# EAGLE design UniversalInterface_RevA (EAGLE 7.6.0)

## Sheet 1 of 2
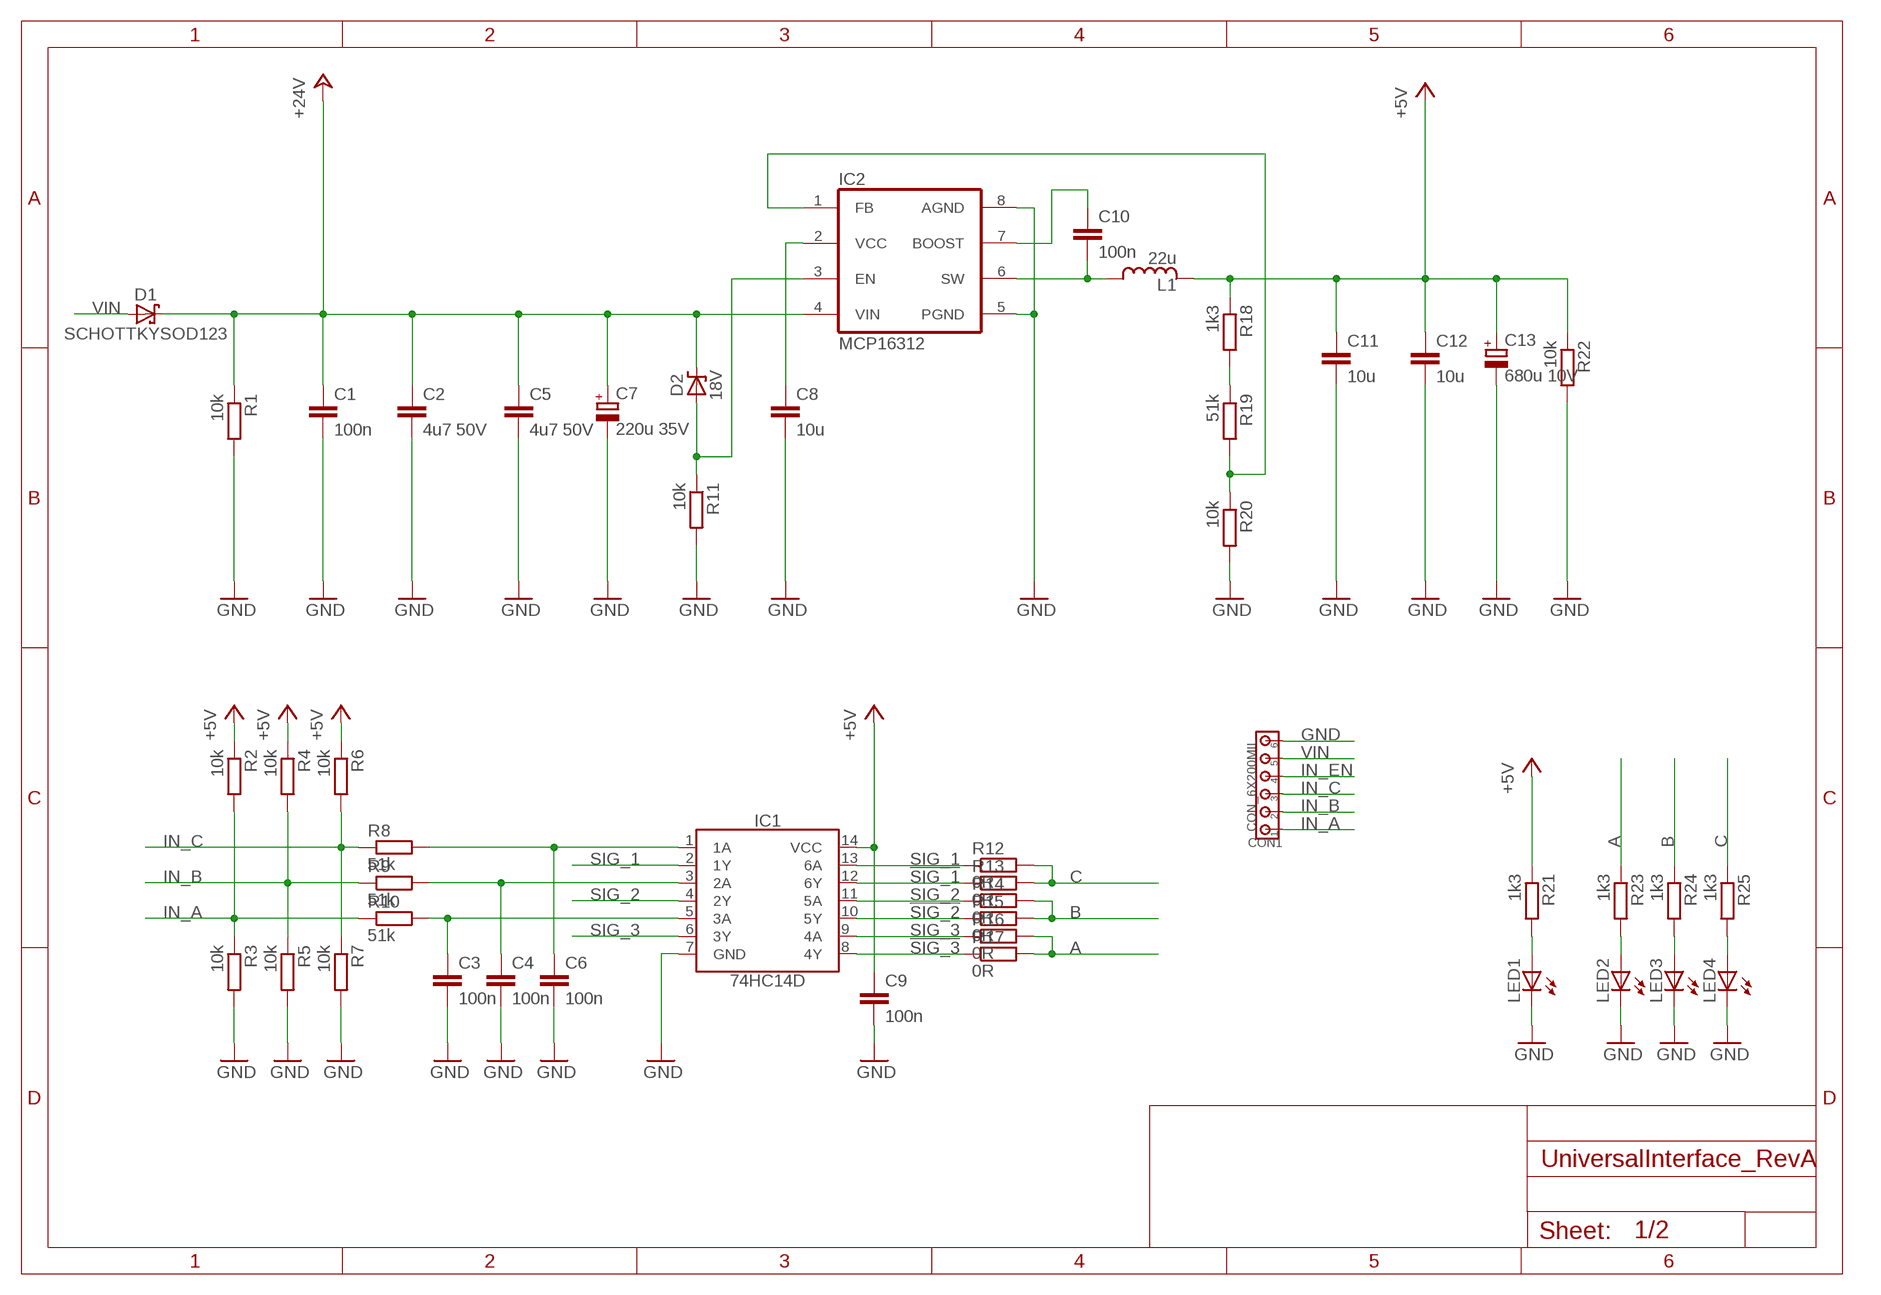
[diagram p0: schematic, sheet 1]

### Parts
C1  100n  CC0805  [C0805]
C2  4u7 50V  CC1206  [C1206]
C3  100n  CC0805  [C0805]
C4  100n  CC0805  [C0805]
C5  4u7 50V  CC1206  [C1206]
C6  100n  CC0805  [C0805]
C7  220u 35V  C_POLARIZED8MM  [8MM]
C8  10u  CC0805  [C0805]
C9  100n  CC0805  [C0805]
C10  100n  CC0805  [C0805]
C11  10u  CC0805  [C0805]
C12  10u  CC0805  [C0805]
C13  680u 10V  C_POLARIZED8MM  [8MM]
CON1  CON_6X200MIL  [200MIL_6X]
D1  SCHOTTKYSOD123  [SOD123]
D2  18V  ZENERSOD323  [SOD323]
IC1  74HC14D  [SO14]
IC2  MCP16312  MCP16311  [MSOP8]
L1  22u  INDUCTORLPS4018  [LPS4018]
LED1  LED0805_NB  [LED0805_NOBOARDER]
LED2  LED0805_NB  [LED0805_NOBOARDER]
LED3  LED0805_NB  [LED0805_NOBOARDER]
LED4  LED0805_NB  [LED0805_NOBOARDER]
R1  10k  RESISTORR0805  [R0805]
R2  10k  RESISTORR0805  [R0805]
R3  10k  RESISTORR0805  [R0805]
R4  10k  RESISTORR0805  [R0805]
R5  10k  RESISTORR0805  [R0805]
R6  10k  RESISTORR0805  [R0805]
R7  10k  RESISTORR0805  [R0805]
R8  51k  RESISTORR0805  [R0805]
R9  51k  RESISTORR0805  [R0805]
R10  51k  RESISTORR0805  [R0805]
R11  10k  RESISTORR0805  [R0805]
R12  0R  RESISTORR0805  [R0805]
R13  0R  RESISTORR0805  [R0805]
R14  0R  RESISTORR0805  [R0805]
R15  0R  RESISTORR0805  [R0805]
R16  0R  RESISTORR0805  [R0805]
R17  0R  RESISTORR0805  [R0805]
R18  1k3  RESISTORR0805  [R0805]
R19  51k  RESISTORR0805  [R0805]
R20  10k  RESISTORR0805  [R0805]
R21  1k3  RESISTORR0805  [R0805]
R22  10k  RESISTORR0805  [R0805]
R23  1k3  RESISTORR0805  [R0805]
R24  1k3  RESISTORR0805  [R0805]
R25  1k3  RESISTORR0805  [R0805]

### Nets
!SIG_1!: IC1.12(6Y) R13.1
!SIG_2!: IC1.10(5Y) R15.1
!SIG_3!: IC1.8(4Y) R17.1
+5V: C9.1 C11.1 C12.1 C13.+ IC1.14(VCC) L1.2 R2.1 R4.1 R6.1 R18.1 R21.1 R22.1 ; also sheet 2
+24V: C1.1 C2.1 C5.1 C7.+ D1.C D2.C IC2.4(VIN) R1.1 ; also sheet 2
A: R16.2 R17.2 R23.1 ; also sheet 2
B: R14.2 R15.2 R24.1 ; also sheet 2
BOOST: C10.1 IC2.7(BOOST)
C: R12.2 R13.2 R25.1 ; also sheet 2
FOO: C3.1 IC1.5(3A) R10.2
GND: C1.2 C2.2 C3.2 C4.2 C5.2 C6.2 C7.- C8.2 C9.2 C11.2 C12.2 C13.- CON1.6 IC1.7(GND) IC2.5(PGND) IC2.8(AGND) LED1.C LED2.C LED3.C LED4.C R1.2 R3.2 R5.2 R7.2 R11.2 R20.2 R22.2 ; also sheet 2
IN_A: CON1.1 R2.2 R3.1 R10.1
IN_B: CON1.2 R4.2 R5.1 R9.1
IN_C: CON1.3 R6.2 R7.1 R8.1
IN_EN: CON1.4 ; also sheet 2
N$1: IC2.1(FB) R19.2 R20.1
N$6: LED1.A R21.2
N$8: D2.A IC2.3(EN) R11.1
N$13: R18.2 R19.1
N$14: C8.1 IC2.2(VCC)
N$17: LED2.A R23.2
N$18: LED3.A R24.2
N$19: LED4.A R25.2
N$40: C6.1 IC1.1(1A) R8.2
N$41: C4.1 IC1.3(2A) R9.2
SIG_1: IC1.2(1Y) IC1.13(6A) R12.1
SIG_2: IC1.4(2Y) IC1.11(5A) R14.1
SIG_3: IC1.6(3Y) IC1.9(4A) R16.1
SWITCH: C10.2 IC2.6(SW) L1.1
VIN: CON1.5 D1.A

## Sheet 2 of 2
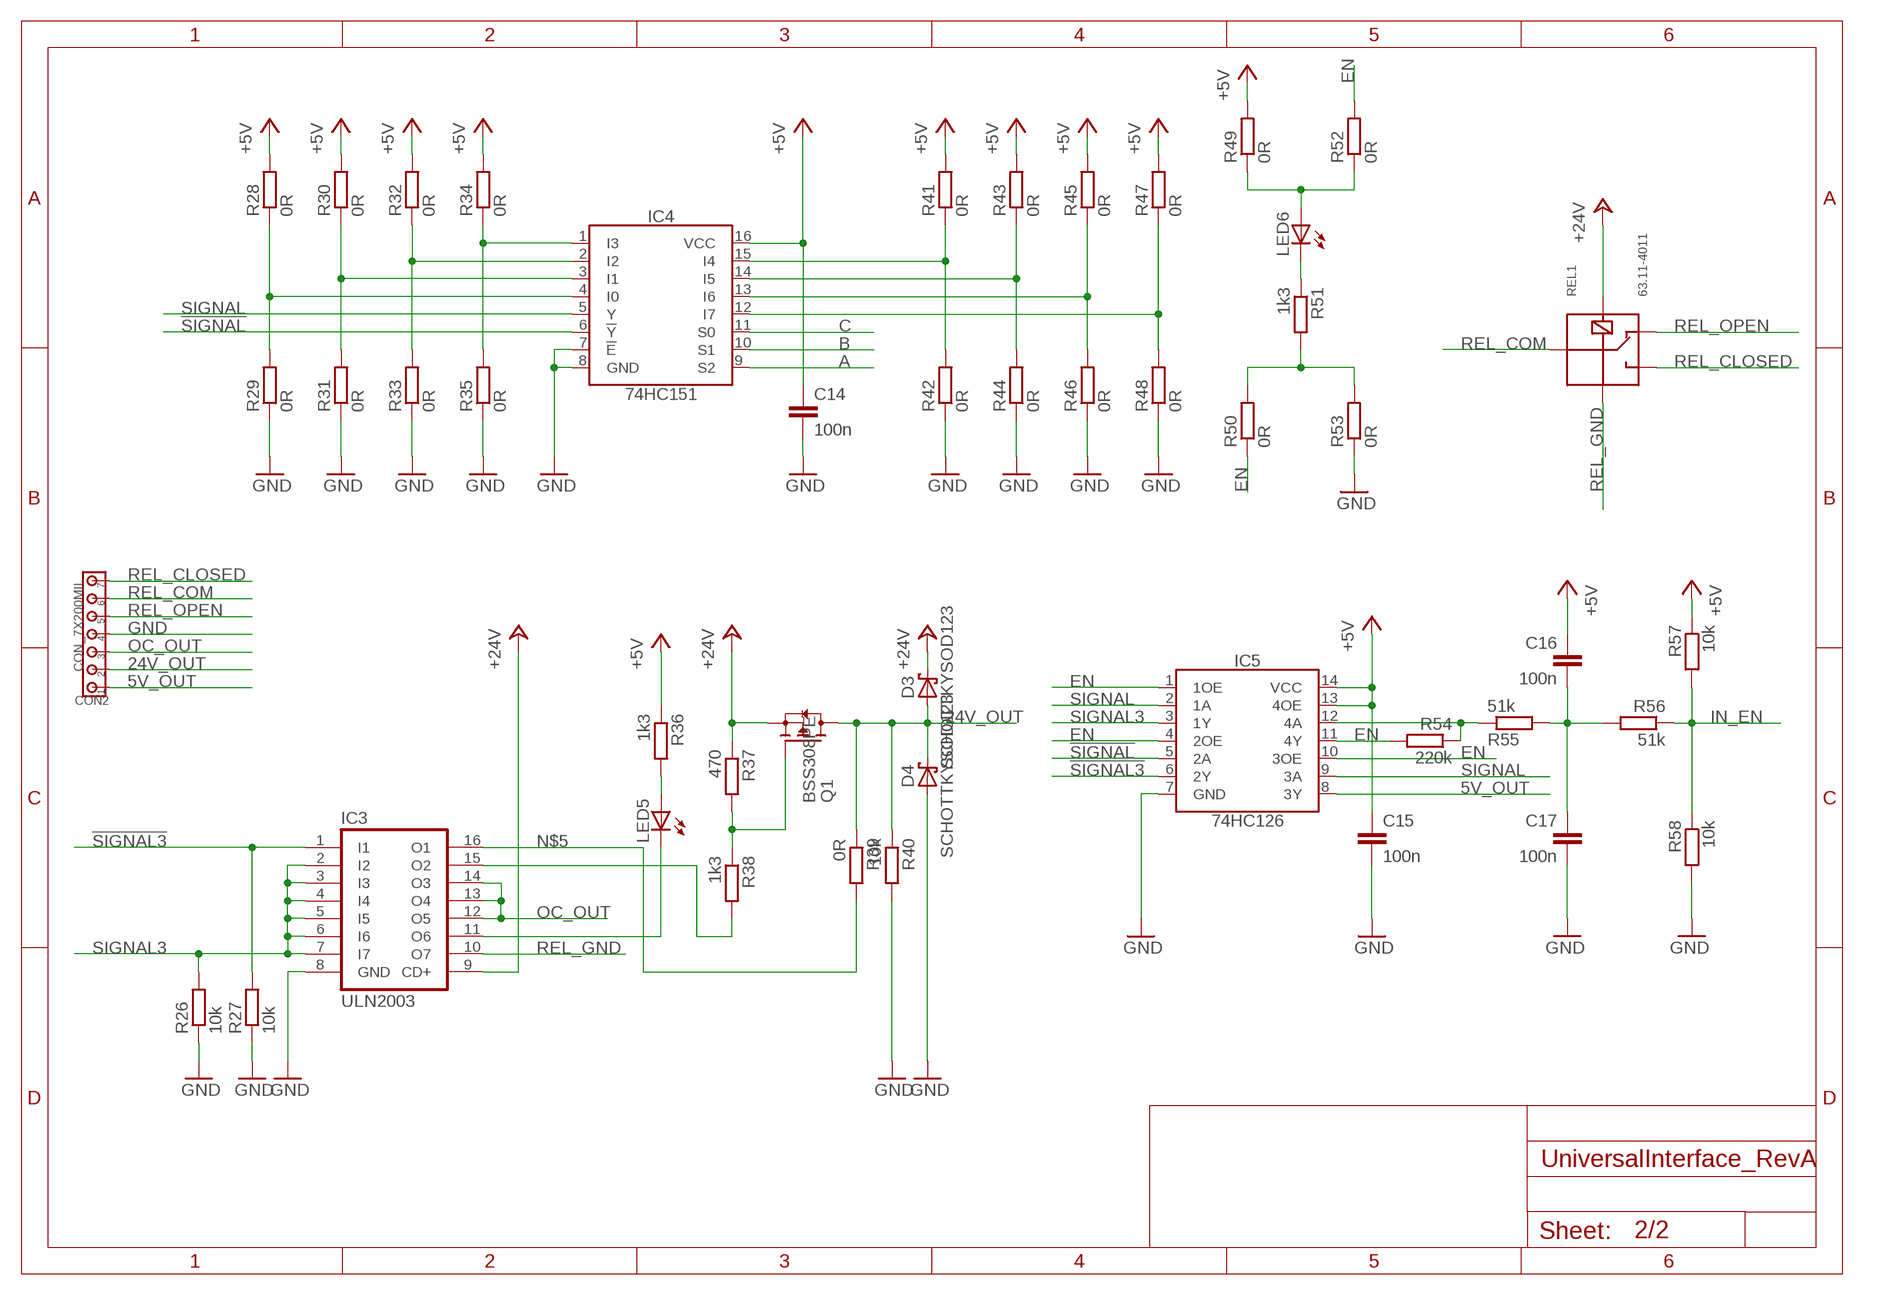
[diagram p1: schematic, sheet 2]

### Parts
C14  100n  CC0805  [C0805]
C15  100n  CC0805  [C0805]
C16  100n  CC0805  [C0805]
C17  100n  CC0805  [C0805]
CON2  CON_7X200MIL  [200MIL_7X]
D3  SCHOTTKYSOD123  [SOD123]
D4  SCHOTTKYSOD123  [SOD123]
IC3  ULN2003  [SO16]
IC4  74HC151  [SO16]
IC5  74HC126  [SO14]
LED5  LED0805_NB  [LED0805_NOBOARDER]
LED6  LED0805_NB  [LED0805_NOBOARDER]
Q1  BSS308PE  P-FETSOT23  [SOT23]
R26  10k  RESISTORR0805  [R0805]
R27  10k  RESISTORR0805  [R0805]
R28  0R  RESISTORR0805_NS  [R0805_NOSILK]
R29  0R  RESISTORR0805_NS  [R0805_NOSILK]
R30  0R  RESISTORR0805_NS  [R0805_NOSILK]
R31  0R  RESISTORR0805_NS  [R0805_NOSILK]
R32  0R  RESISTORR0805_NS  [R0805_NOSILK]
R33  0R  RESISTORR0805_NS  [R0805_NOSILK]
R34  0R  RESISTORR0805_NS  [R0805_NOSILK]
R35  0R  RESISTORR0805_NS  [R0805_NOSILK]
R36  1k3  RESISTORR0805  [R0805]
R37  470  RESISTORR0805  [R0805]
R38  1k3  RESISTORR0805  [R0805]
R39  0R  RESISTORR0805  [R0805]
R40  10k  RESISTORR0805  [R0805]
R41  0R  RESISTORR0805_NS  [R0805_NOSILK]
R42  0R  RESISTORR0805_NS  [R0805_NOSILK]
R43  0R  RESISTORR0805_NS  [R0805_NOSILK]
R44  0R  RESISTORR0805_NS  [R0805_NOSILK]
R45  0R  RESISTORR0805_NS  [R0805_NOSILK]
R46  0R  RESISTORR0805_NS  [R0805_NOSILK]
R47  0R  RESISTORR0805_NS  [R0805_NOSILK]
R48  0R  RESISTORR0805_NS  [R0805_NOSILK]
R49  0R  RESISTORR0805  [R0805]
R50  0R  RESISTORR0805  [R0805]
R51  1k3  RESISTORR0805  [R0805]
R52  0R  RESISTORR0805  [R0805]
R53  0R  RESISTORR0805  [R0805]
R54  220k  RESISTORR0805  [R0805]
R55  51k  RESISTORR0805  [R0805]
R56  51k  RESISTORR0805  [R0805]
R57  10k  RESISTORR0805  [R0805]
R58  10k  RESISTORR0805  [R0805]
REL1  63.11-4011  [G5LE]

### Nets
5V_OUT: CON2.1 IC5.8(3Y)
24V_OUT: CON2.2 D3.A D4.C Q1.3(D) R39.1 R40.1
!SIGNAL3!: IC3.1(I1) IC5.6(2Y) R27.2
!SIGNAL!: IC4.6(!Y!) IC5.5(2A)
+5V: C14.1 C15.1 C16.1 IC4.16(VCC) IC5.13(4OE) IC5.14(VCC) R28.2 R30.2 R32.2 R34.2 R36.1 R41.2 R43.2 R45.2 R47.2 R49.2 R57.1 ; also sheet 1
+24V: D3.C IC3.9(CD+) Q1.2(S) R37.1 REL1.2 ; also sheet 1
A: IC4.9(S2) ; also sheet 1
B: IC4.10(S1) ; also sheet 1
C: IC4.11(S0) ; also sheet 1
EN: IC5.1(1OE) IC5.4(2OE) IC5.10(3OE) IC5.11(4Y) R50.1 R52.2 R54.2
GND: C14.2 C15.2 C17.2 CON2.4 D4.A IC3.8(GND) IC4.7(!E!) IC4.8(GND) IC5.7(GND) R26.1 R27.1 R29.1 R31.1 R33.1 R35.1 R40.2 R42.1 R44.1 R46.1 R48.1 R53.1 R58.2 ; also sheet 1
I0: IC4.4(I0) R28.1 R29.2
I1: IC4.3(I1) R30.1 R31.2
I2: IC4.2(I2) R32.1 R33.2
I3: IC4.1(I3) R34.1 R35.2
I4: IC4.15(I4) R41.1 R42.2
I5: IC4.14(I5) R43.1 R44.2
I6: IC4.13(I6) R45.1 R46.2
I7: IC4.12(I7) R47.1 R48.2
IN_EN: R56.1 R57.2 R58.1 ; also sheet 1
N$2: C16.2 C17.1 R55.2 R56.2
N$4: LED6.C R51.1
N$5: IC3.16(O1) R39.2
N$11: IC3.11(O6) LED5.C
N$12: IC5.12(4A) R54.1 R55.1
N$24: LED6.A R49.1 R52.1
N$25: LED5.A R36.2
N$27: Q1.1(G) R37.2 R38.1
N$28: IC3.15(O2) R38.2
N$30: R50.2 R51.2 R53.2
OC_OUT: CON2.3 IC3.12(O5) IC3.13(O4) IC3.14(O3)
REL_CLOSED [relay]: CON2.7 REL1.C
REL_COM [relay]: CON2.6 REL1.COM
REL_GND: IC3.10(O7) REL1.1
REL_OPEN [relay]: CON2.5 REL1.O
SIGNAL: IC4.5(Y) IC5.2(1A) IC5.9(3A)
SIGNAL3: IC3.2(I2) IC3.3(I3) IC3.4(I4) IC3.5(I5) IC3.6(I6) IC3.7(I7) IC5.3(1Y) R26.2

## Library data of the parts
C1-C6 C8-C12 C14-C17 = 00Capacitor:C: Capacitor
C7 C13 = 00Capacitor:C_POLARIZED
CON1 = 00Connector:CON_6X: 6-pin header
CON2 = 00Connector:CON_7X: 7-pin header
D1 D3 D4 = 00Diode:SCHOTTKY
D2 = 00Diode:ZENER
IC1 = 00Logic:74HC14: Hex Inverter Schmitt Trigger
IC2 = 00VoltageRegulator:MCP16311
IC3 = 00Transistor:ULN2003: Seven Darlington array
IC4 = 00Logic:74HC151: 8-input multiplexer
IC5 = 00Logic:74HC126: Quad buffer/line driver; 3-state
L1 = 00Inductor:INDUCTOR
LED1-LED6 = 00Display:LED: LED
Q1 = 00Mosfet:P-FET
R1-R58 = 00Resistor:RESISTOR: RESISTOR, European symbol
REL1 = 00Switch:63.11-4011: SPDT Relay

## Net classes
1 24V: clearance 0.305 mm
2 relay: width 1.778 mm, drill 1.3 mm, clearance 1 mm to class 0, clearance 1 mm to class 1, clearance 1 mm
5 +5v: width 0.61 mm, drill 0.6 mm, clearance 0.254 mm to class 0, clearance 0.254 mm to class 1, clearance 0.254 mm to class 2, clearance 0.254 mm to class 3, clearance 0.254 mm to class 4, clearance 0.254 mm

## Board
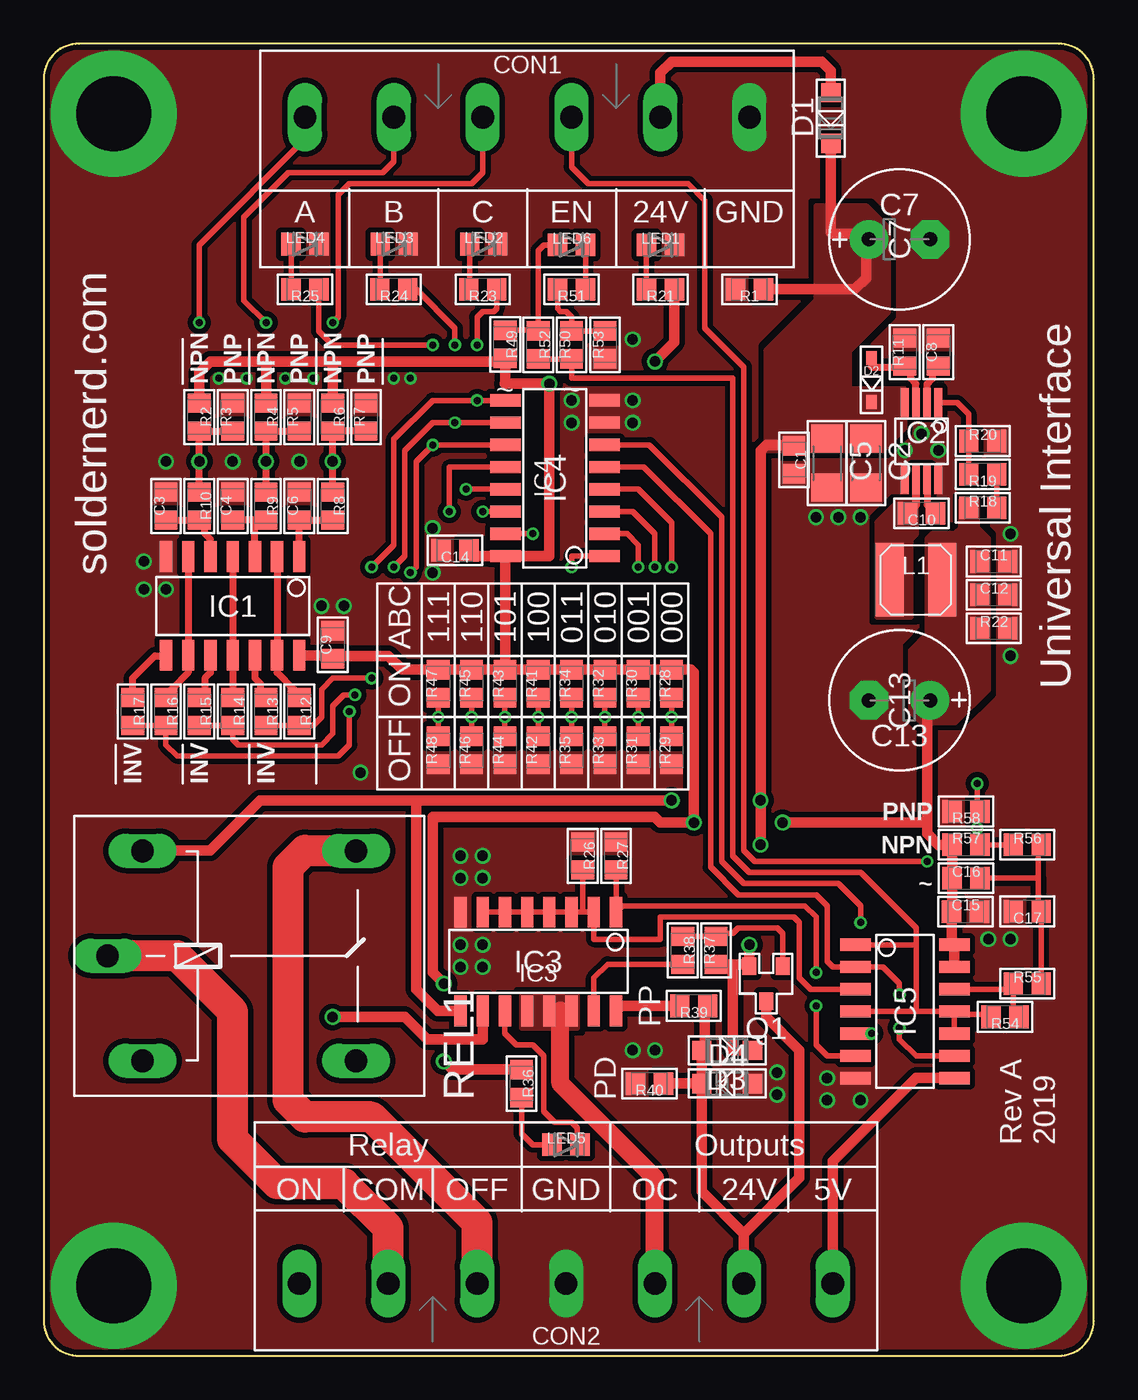
[diagram p2: board, top side]
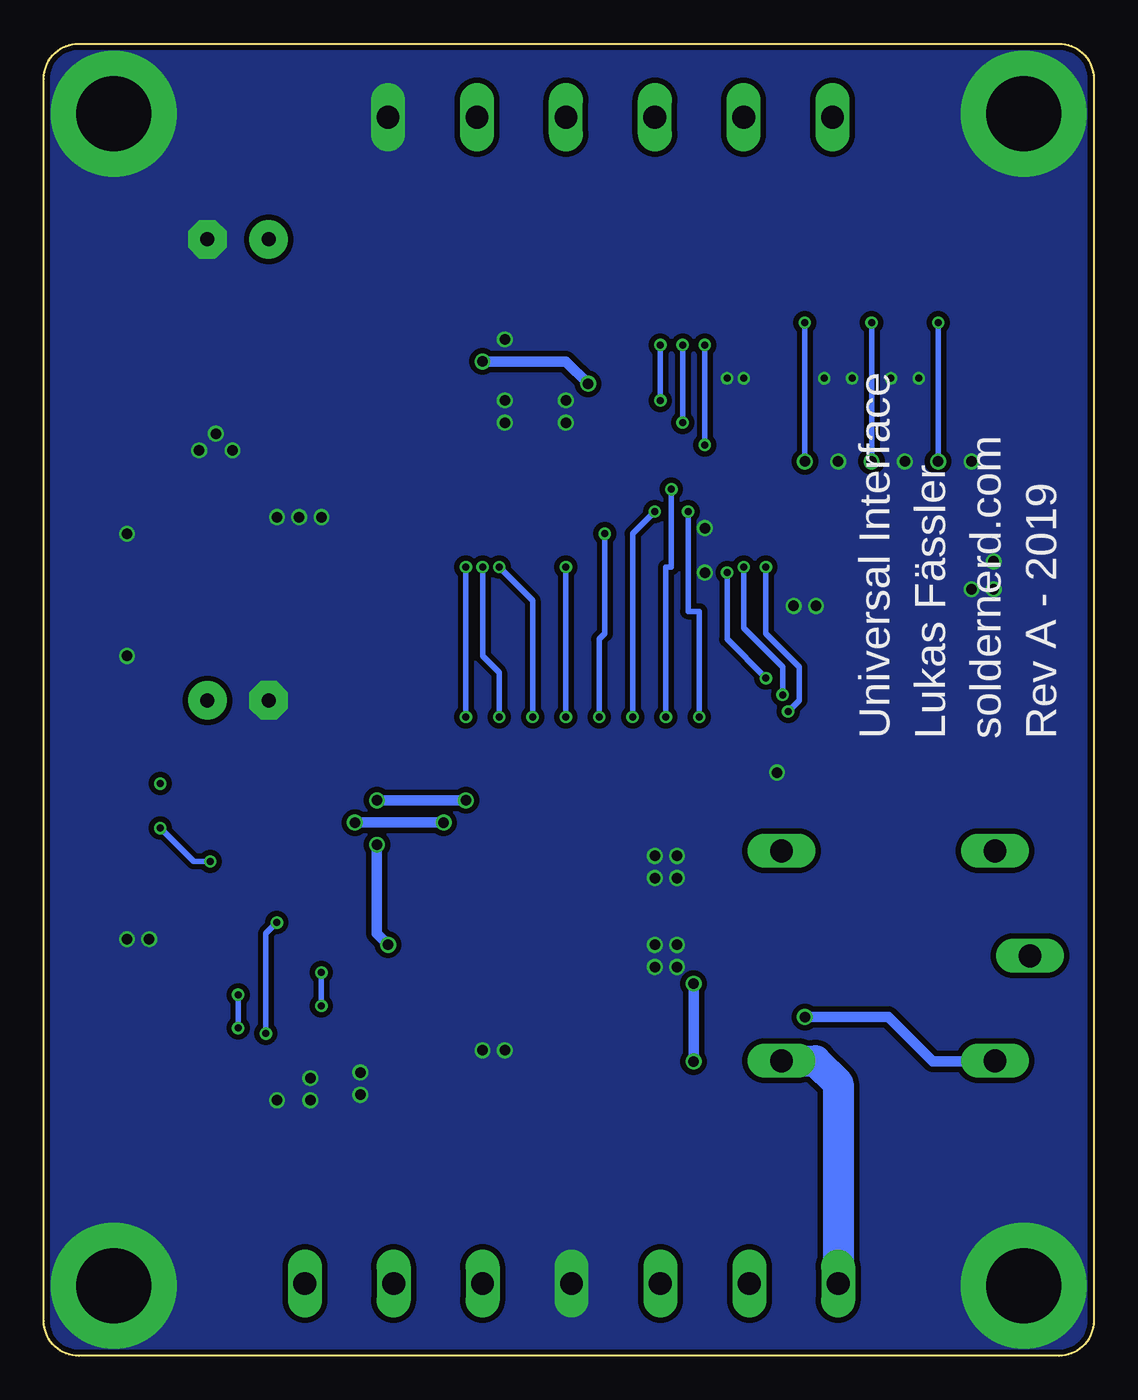
[diagram p3: board, bottom side, seen from below]

Size 60 x 75 mm. Coordinates in mm from the lower left corner, seen from the top.
Outline: 58,0 arc90 60,2 60,73 arc90 58,75 2,75 arc90 0,73 0,2 arc90 2,0 58,0
Copper layers (1*16): Top 0.035mm / dielectric 1.5mm / Bottom 0.035mm
Design rules "dirt_cheap_dirty_boards.7mil": minimum track width 5mil, minimum drill 12mil, track to track 7mil, track to pad 7mil, pad to pad 7mil, via to via 7mil, smd to smd 0mil, copper to edge 10mil, drill to drill 10mil, minimum pad ring 10mil, minimum via ring 6mil, stop-mask expansion 2mil, vias tented up to drill 25mil, thermal gap 10mil

### Footprints (pad centres in the part's own frame; a part is rotated, then mirrored left to right if it is on the bottom)
C0805 = smd 1.1 x 1.3: 1 -0.8,0; 2 0.8,0
C1206 = smd 1.6 x 1.8: 1 -1.4,0; 2 1.4,0
8MM = drill 0.8 pad 2.2: + -1.75,0 | drill 0.8 pad 2.2 octagon: - 1.75,0
200MIL_6X = drill 1.3 long: 1 -12.7,0; 2 -7.62,0; 3 -2.54,0; 4 2.54,0; 5 7.62,0; 6 12.7,0
200MIL_7X = drill 1.3 long: 1 -15.24,0; 2 -10.16,0; 3 -5.08,0; 4 0,0; 5 5.08,0; 6 10.16,0; 7 15.24,0
SOD123 = smd 1.1 x 1.1: A 1.45,0; C -1.45,0
SOD323 = smd 0.8 x 0.6: A 1.25,0; C -1.25,0
SO14 = smd 0.7 x 1.75: 1 -3.81,-2.825; 2 -2.54,-2.825; 3 -1.27,-2.825; 4 0,-2.825; 5 1.27,-2.825; 6 2.54,-2.825; 7 3.81,-2.825; 8 3.81,2.825; 9 2.54,2.825; 10 1.27,2.825; 11 0,2.825; 12 -1.27,2.825; 13 -2.54,2.825; 14 -3.81,2.825
MSOP8 = smd 1.65 x 0.45: 1 -2.2,0.953; 2 -2.2,0.318; 3 -2.2,-0.318; 4 -2.2,-0.953; 5 2.2,-0.953; 6 2.2,-0.318; 7 2.2,0.318; 8 2.2,0.953
SO16 = smd 0.7 x 1.75: 1 -4.445,-2.825; 2 -3.175,-2.825; 3 -1.905,-2.825; 4 -0.635,-2.825; 5 0.635,-2.825; 6 1.905,-2.825; 7 3.175,-2.825; 8 4.445,-2.825; 9 4.445,2.825; 10 3.175,2.825; 11 1.905,2.825; 12 0.635,2.825; 13 -0.635,2.825; 14 -1.905,2.825; 15 -3.175,2.825; 16 -4.445,2.825
LPS4018 = smd 1.6 x 4.2: 1 -1.5,0; 2 1.5,0
LED0805_NOBOARDER = smd 1.1 x 1.3: A -0.8,0; C 0.8,0
SOT23 = smd 0.8 x 1: 1 -0.95,-1; 2 0.95,-1; 3 0,1
R0805 = smd 1.1 x 1.3: 1 -0.8,0; 2 0.8,0
R0805_NOSILK = smd 1.1 x 1.3: 1 -0.8,0; 2 0.8,0
G5LE = drill 1.3 long: 1 -6.1,-6; 2 -6.1,6; C 6.1,-6; COM -8.1,0; O 6.1,6

### Placement (x,y rotation side)
C1  42.87,51.22 270 top
C2  46.98,51.02 270 top
C3  6.99,48.58 90 top
C4  10.79,48.58 90 top
C5  44.76,51.02 270 top
C6  14.61,48.58 90 top
C7  48.9,63.82 0 top
C8  51.11,57.37 90 top
C9  16.51,40.64 90 top
C10  50.16,48.16 180 top
C11  54.29,45.4 0 top
C12  54.29,43.5 0 top
C13  48.9,37.47 180 top
C14  23.5,46.04 180 top
C15  52.67,25.39 0 top
C16  52.7,27.3 0 top
C17  56.2,25.4 180 top
CON1  27.62,70.8 0 top
CON2  29.84,4.13 180 top
D1  44.98,70.75 90 top
D2  47.3,55.78 90 top
D3  39.05,17.46 180 top
D4  39.05,15.56 0 top
IC1  10.79,42.86 180 top
IC2  50.16,52.28 270 top
IC3  28.26,22.54 180 top
IC4  29.21,50.16 90 top
IC5  49.21,19.68 270 top
L1  49.84,44.35 0 top
LED1  35.24,63.5 0 top
LED2  25.14,63.54 0 top
LED3  20.04,63.54 0 top
LED4  14.93,63.54 0 top
LED5  29.84,12.06 0 top
LED6  30.16,63.5 0 top
Q1  41.27,21.27 180 top
R1  40.32,60.96 180 top
R2  8.89,53.66 270 top
R3  10.79,53.66 90 top
R4  12.7,53.66 270 top
R5  14.61,53.66 90 top
R6  16.51,53.66 270 top
R7  18.41,53.66 90 top
R8  16.51,48.58 270 top
R9  12.7,48.58 270 top
R10  8.89,48.58 270 top
R11  49.2,57.37 90 top
R12  14.61,36.83 270 top
R13  12.7,36.83 270 top
R14  10.79,36.83 270 top
R15  8.89,36.83 270 top
R16  6.99,36.83 270 top
R17  5.08,36.83 270 top
R18  53.65,48.48 0 top
R19  53.65,50.38 180 top
R20  53.65,52.28 0 top
R21  35.24,60.96 180 top
R22  54.29,41.59 0 top
R23  25.08,60.96 180 top
R24  20,60.96 180 top
R25  14.92,60.96 180 top
R26  30.8,28.57 270 top
R27  32.7,28.57 270 top
R28  35.88,38.42 90 top
R29  35.88,34.61 90 top
R30  33.97,38.42 90 top
R31  33.97,34.61 90 top
R32  32.07,38.42 90 top
R33  32.07,34.61 90 top
R34  30.16,38.42 90 top
R35  30.16,34.61 90 top
R36  27.3,15.56 270 top
R37  38.42,23.18 90 top
R38  36.51,23.18 270 top
R39  37.15,20 180 top
R40  34.61,15.56 180 top
R41  28.26,38.42 90 top
R42  28.26,34.61 90 top
R43  26.35,38.42 90 top
R44  26.35,34.61 90 top
R45  24.45,38.42 90 top
R46  24.45,34.61 90 top
R47  22.54,38.42 90 top
R48  22.54,34.61 90 top
R49  26.36,57.81 270 top
R50  30.16,57.78 90 top
R51  30.16,60.96 180 top
R52  28.26,57.78 270 top
R53  32.07,57.78 90 top
R54  54.93,19.37 180 top
R55  56.2,21.27 0 top
R56  56.2,29.21 0 top
R57  52.7,29.21 0 top
R58  52.7,31.11 180 top
REL1  11.75,22.86 0 top

### Tracks (layer width: path | path; a pad name or v marks a point on that pad's centre or on a via)
5V_OUT
  Top 0.305: 52.07,15.88 IC5.8
  Top 0.61: 52.07,15.88 49.85,15.88 45.09,11.11 CON2.1
24V_OUT
  Top 0.61: D4.C D3.A 37.78,17.46 37.78,19.84 R39.1 | D4.C R40.1 | CON2.2 40.01,6.99 | 40.01,6.99 37.6,9.39 D4.C | Q1.3 41.27,19.37 43.18,17.46 43.18,10.16 40.01,6.99
!SIG_1!
  Top 0.406: IC1.12 12.06,38.73 12.38,38.42 12.38,37.95 R13.1
!SIG_2!
  Top 0.406: IC1.10 9.53,39.05 9.21,38.73 9.21,37.95 R15.1
!SIG_3!
  Top 0.406: R17.1 5.08,38.73 6.35,40.01 6.95,40.01 IC1.8
!SIGNAL3!  (via drill 0.4)
  Top 0.305: R27.2 IC3.1 | IC3.1 32.7,25.4 | v44.13,21.91 44.13,25.08 43.5,25.72 33.05,25.72 IC3.1 | IC5.6 44.77,17.14 44.13,17.78 v44.13,20
  Bottom 0.305: v44.13,21.91 v44.13,20
!SIGNAL!  (via drill 0.4)
  Top 0.305: IC4.6 34.61,52.07 38.73,47.94 38.73,28.26 40.01,26.99 45.4,26.99 46.67,25.72 v46.67,24.77 | IC5.5 v47.31,18.41
  Bottom 0.305: v46.67,24.77 47.31,24.13 v47.31,18.41
+5V  (via drill 0.6)
  Top 0.305: 51.88,23.5 IC5.14 | 51.88,27.3 C16.1 | R43.2 26.39,39.22
  Top 0.61: IC1.14 16.31,40.04 C9.1 16.68,40.01 19.68,40.01 20.47,39.22 R47.2 R45.2 R43.2 R41.2 R34.2 R32.2 R30.2 R28.2 36.98,39.22 37.15,39.05 v37.15,30.48 35.24,30.48 34.92,30.8 22.23,30.8 22.23,21.91 v22.86,21.27 | 26.39,39.22 IC4.16 | IC4.16 24.3,45.72 C14.1 | IC4.16 28.89,45.72 v28.89,55.56 26.35,55.56 26.36,55.58 R49.2 26.18,56.83 16.51,56.83 | R2.1 8.89,56.2 9.53,56.83 12.7,56.83 | 12.7,56.83 16.51,56.83 | R4.1 12.7,56.83 | R6.1 16.51,56.83 | IC5.13 IC5.14 51.88,23.66 C15.1 51.91,25.42 C16.1 R57.1 51.12,29.21 50.48,29.84 50.48,30.48 | C13.+ 50.48,37.3 50.48,30.48 | 50.48,30.48 v42.23,30.48 | R36.1 23.33,16.36 v22.86,16.83 | R21.1 36.04,57.95 v34.92,56.83
  Bottom 0.61: v34.92,56.83 30.16,56.83 v28.89,55.56 | v37.15,30.48 v42.23,30.48 | v22.86,21.27 v22.86,16.83
  pour Top (isolate 0.305, no thermals): 52.39,48.9 52.39,47.31 52.07,46.99 50.8,46.99 50.48,46.67 50.48,41.27 49.53,40.32 49.53,36.83 50.16,36.2 52.07,36.2 53.98,38.1 53.98,46.67 53.34,47.31 53.34,48.9
+24V  (via drill 0.6)
  Top 0.305: 38.42,22.27 R37.1 | Q1.2
  Top 0.61: 23.81,19.68 IC3.9 22.51,19.72 21.27,20.95 21.27,31.75 | R1.1 46.35,60.96 46.99,61.59 46.99,63.66 C7.+ 46.83,64.14 45.09,64.14 44.98,64.24 D1.C | 41.92,52.06 41.91,52.07 | 21.27,31.75 v35.88,31.75 | v40.96,29.21 v40.96,31.75 40.96,51.75 41.27,52.07 42.55,52.07 42.59,52.02 C1.1 | Q1.2 v40.32,23.5 | Q1.2 40.22,22.38 39.37,22.38 | 39.37,22.38 R37.1 | D3.C 39.37,17.46 39.37,22.38 | 21.27,31.75 12.38,31.75 9.53,28.89 5.68,28.89 REL1.2
  Bottom 0.61: v35.88,31.75 v40.96,31.75 | v40.32,23.5 40.96,24.13 v40.96,29.21
  pour Top (isolate 0.305, no thermals): 49.21,55.24 49.21,53.02 47.94,51.75 41.27,51.75 41.27,57.47 44.13,60.33 44.13,65.72 46.99,65.72 48.26,64.45 48.26,59.69 46.04,57.47 46.04,55.24
A  (via drill 0.4)
  Top 0.305: IC4.9 v24.77,54.61 22.23,54.61 20,52.39 20,46.35 v18.73,45.09 | R17.2 R16.2 6.99,34.92 7.62,34.29 16.83,34.29 17.46,34.92 v17.46,36.83 | R23.1 25.88,59.85 25.72,59.69 25.08,59.69 24.77,59.37 v24.77,57.78
  Bottom 0.305: v18.73,45.09 18.73,41.27 16.83,39.37 16.83,37.47 v17.46,36.83 | v24.77,57.78 v24.77,54.61
B  (via drill 0.4)
  Top 0.305: R15.2 R14.2 10.79,35.24 11.11,34.92 15.88,34.92 16.51,35.56 16.51,37.15 17.14,37.78 v17.78,37.78 | IC4.10 v23.5,53.34 22.23,53.34 20.64,51.75 20.64,45.72 v20,45.09 | R24.1 21.27,60.96 23.5,58.74 v23.5,57.78
  Bottom 0.305: v20,45.09 20,41.59 17.78,39.37 v17.78,37.78 | v23.5,57.78 v23.5,53.34
BOOST
  Top 0.406: IC2.7 50.48,48.64 C10.1
C  (via drill 0.4)
  Top 0.305: IC4.11 v22.23,52.07 21.27,51.12 21.27,45.09 v20.95,44.77 | R13.2 R12.2 15.39,36.03 15.88,36.51 15.88,38.1 16.51,38.73 v18.73,38.73 | R25.1 15.72,58.57 16.51,57.78 v22.23,57.78
  Bottom 0.305: v20.95,44.77 20.95,40.96 v18.73,38.73 | v22.23,57.78 v22.23,52.07
EN
  Top 0.305: IC5.10 52.04,19.52 | 49.85,19.68 IC5.11 52.04,19.52 | 49.85,19.68 IC5.4 | IC5.1 49.85,23.5 | 49.85,23.5 49.85,19.68 | R52.2 R50.1 30.16,55.88 39.37,55.88 39.37,28.57 40.32,27.62 46.67,27.62 49.85,24.45 49.85,23.5 | 52.04,19.52 53.98,19.52 R54.2
FOO
  Top 0.406: C3.1 R10.2 9.21,47.46 9.21,46.99 9.53,46.67 IC1.5
GND  (via drill 0.4, 0.6, 4.3 pad 7.2)
  other vias: 4,71 56,71 56,4 4,4 14.61,51.12 6.99,51.12 10.79,51.12 15.88,42.86 5.71,45.4 10,55.88 11.59,55.88 13.81,55.88 15.4,55.88 17.14,42.86 6.99,43.81 5.71,43.81 22.23,47.31 22.23,44.77 20,55.88 20.95,55.88 30.16,54.61 30.16,53.34 33.66,54.61 33.66,53.34 33.66,58.1 53.98,23.81 55.24,23.81 23.81,28.57 25.08,28.57 25.08,27.3 23.81,27.3 23.81,23.5 25.08,23.5 25.08,22.23 23.81,22.23 33.66,17.46 34.92,17.46 44.13,47.94 45.4,47.94 46.67,47.94 50.16,52.7 51.12,51.75 49.21,51.75 44.77,15.88 44.77,14.61 46.67,14.61 55.24,46.99 55.24,40.01 41.91,16.19 41.91,14.92 18.1,33.34
  pour Bottom (isolate 0.305, rank 3, no thermals): 58,0 2,0 arc-90 0,2 0,73 arc-90 2,75 58,75 arc-90 60,73 60,2 arc-90
  pour Top (isolate 0.305, rank 3, no thermals): 0,2 0,73 arc-90 2,75 58,75 arc-90 60,73 60,2 arc-90 58,0 2,0 arc-90
I0  (via drill 0.4)
  Top 0.305: R29.2 v35.88,36.51 R28.1 | IC4.4 33.97,49.53 35.88,47.62 v35.88,45.09
  Bottom 0.305: v35.88,45.09 v35.88,36.51
I1  (via drill 0.4)
  Top 0.305: R31.2 v33.97,36.51 R30.1 | IC4.3 33.66,48.26 34.92,46.99 v34.92,45.09
  Bottom 0.305: v34.92,45.09 34.92,40.01 33.97,39.05 v33.97,36.51
I2  (via drill 0.4)
  Top 0.305: R33.2 v32.07,36.51 R32.1 | IC4.2 33.34,46.99 33.97,46.35 v33.97,45.09
  Bottom 0.305: v33.97,45.09 32.07,43.18 v32.07,36.51
I3  (via drill 0.4)
  Top 0.305: R35.2 v30.16,36.51 R34.1 | IC4.1 30.16,45.72 v30.16,45.09
  Bottom 0.305: v30.16,45.09 v30.16,36.51
I4  (via drill 0.4)
  Top 0.305: R42.2 v28.26,36.51 R41.1 | IC4.15 v27.94,46.99
  Bottom 0.305: v27.94,46.99 27.94,41.27 28.26,40.96 v28.26,36.51
I5  (via drill 0.4)
  Top 0.305: R44.2 v26.35,36.51 R43.1 | IC4.14 v25.08,48.26
  Bottom 0.305: v26.35,36.51 26.35,46.99 v25.08,48.26
I6  (via drill 0.4)
  Top 0.305: R46.2 v24.45,36.51 R45.1 | IC4.13 v24.13,49.53
  Bottom 0.305: v24.45,36.51 24.45,45.09 24.13,45.09 v24.13,49.53
I7  (via drill 0.4)
  Top 0.305: R48.2 v22.54,36.51 R47.1 | IC4.12 23.18,50.8 v23.18,48.26
  Bottom 0.305: v23.18,48.26 23.18,42.55 22.54,42.55 v22.54,36.51
IN_A  (via drill 0.4, 0.6)
  Top 0.305: CON1.1 14.92,69.53 8.89,63.5 v8.89,59.05
  Top 0.406: R10.1 v8.89,51.12 R2.2 R3.1
  Bottom 0.305: v8.89,59.05 v8.89,51.12
IN_B  (via drill 0.4, 0.6)
  Top 0.305: CON1.2 20,68.26 19.37,67.63 13.97,67.63 11.43,65.09 11.43,60.33 v12.7,59.05
  Top 0.406: R9.1 v12.7,51.12 R4.2 R5.1
  Bottom 0.305: v12.7,59.05 v12.7,51.12
IN_C  (via drill 0.4, 0.6)
  Top 0.305: CON1.3 25.08,67.63 24.45,66.99 17.46,66.99 16.83,66.36 16.83,59.37 v16.51,59.05
  Top 0.406: R8.1 v16.51,51.12 R6.2 R7.1
  Bottom 0.305: v16.51,59.05 v16.51,51.12
IN_EN  (via drill 0.4)
  Top 0.305: R56.1 R57.2 53.34,29.38 v53.34,30.16 53.34,30.8 53.51,30.96 R58.1 53.34,31.28 v53.34,32.7 | CON1.4 30.16,67.94 31.11,66.99 36.83,66.99 37.78,66.04 37.78,58.74 40.01,56.52 40.01,28.89 40.64,28.26 v50.48,28.26
  Bottom 0.305: v50.48,28.26 51.44,28.26 v53.34,30.16
N$1
  Top 0.305: R19.2 R20.1 52.85,53.83 52.2,54.48 IC2.1
N$2
  Top 0.305: C16.2 56.83,27.3 | 56.83,27.3 56.83,29.21 R56.2 | 56.83,27.3 56.83,25.4 C17.1 R55.2
N$4
  Top 0.305: R51.1 LED6.C
N$5
  Top 0.61: 32.7,19.88 IC3.16 32.99,20 R39.2
N$6
  Top 0.305: LED1.A R21.2
N$8
  Top 0.406: D2.A 47.3,56.52 47.31,56.52 49.16,56.52 R11.1 49.53,56.24 49.53,55.88 49.84,55.57 IC2.3
N$11
  Top 0.305: IC3.11 26.35,18.41 26.99,17.78 27.94,17.78 28.57,17.14 28.57,13.97 29.21,13.34 30.16,13.34 30.48,13.02 30.48,12.23 LED5.C
N$12
  Top 0.305: IC5.12 55.08,20.95 R55.1 55.4,19.7 R54.1
N$13
  Top 0.305: R19.1 R18.2
N$14
  Top 0.406: IC2.2 50.48,55.55 50.8,55.88 50.8,56.26 C8.1
N$17
  Top 0.305: LED2.A 24.34,60.96 R23.2
N$18
  Top 0.305: LED3.A 19.23,60.96 R24.2
N$19
  Top 0.305: LED4.A 14.13,60.96 R25.2
N$24
  Top 0.305: R49.1 28.23,58.62 R52.1 28.26,63.18 28.57,63.5 LED6.A
N$25
  Top 0.305: LED5.A 27.94,12.06 27.3,12.7 R36.2
N$27
  Top 0.305: R38.1 R37.2 38.57,24.13 39.37,24.13 39.69,24.45 41.91,24.45 42.23,24.13 Q1.1
N$28
  Top 0.305: IC3.15 31.43,21.59 32.22,22.38 R38.2
N$30
  Top 0.305: R53.2 R50.2 30.16,59.37 29.84,59.69 29.53,59.69 29.36,59.85 R51.2
N$40
  Top 0.406: R8.2 C6.1 IC1.1
N$41
  Top 0.406: R9.2 12.06,47.78 | 12.06,47.78 C4.1 | IC1.3 12.06,47.78
OC_OUT
  Top 0.305: IC3.13 29.53,19.72 IC3.14
  Top 1.016: CON2.3 34.92,10.16 29.53,15.56 29.53,19.72
  pour Top (isolate 0.305, no thermals): 27.3,20.64 30.48,20.64 30.48,18.73 27.3,18.73
REL_CLOSED
  Bottom 1.778: REL1.C 15.91,16.86 14.61,15.56 CON2.7
REL_COM
  Top 1.778: CON2.6 19.68,7.3 17.14,9.84 13.34,9.84 10.79,12.38 10.79,19.68 7.62,22.86 REL1.COM
REL_GND  (via drill 0.6)
  Top 0.61: IC3.10 25.08,18.1 21.91,18.1 20.64,19.37 v16.51,19.37
  Bottom 0.61: v16.51,19.37 11.75,19.37 9.21,16.83 5.68,16.83 REL1.1
REL_OPEN
  Top 1.778: CON2.5 24.77,7.62 18.73,13.65 14.92,13.65 13.97,14.61 13.97,27.94 14.92,28.89 17.82,28.89 REL1.O
SIG_1
  Top 0.406: IC1.2 IC1.13 13.34,39.05 14.29,38.1 14.29,37.95 R12.1
SIG_2
  Top 0.406: IC1.4 IC1.11 R14.1
SIG_3
  Top 0.406: IC1.6 IC1.9 8.26,39.05 7.3,38.1 7.3,37.95 R16.1
SIGNAL  (via drill 0.4)
  Top 0.305: IC4.5 34.29,50.8 38.1,46.99 38.1,27.94 39.69,26.35 44.13,26.35 44.77,25.72 44.77,22.54 45.09,22.23 IC5.2 47.94,22.23 48.9,21.27 v48.9,20.64 | IC5.9 49.85,17.14 48.9,18.1 v48.9,18.73
  Bottom 0.305: v48.9,20.64 v48.9,18.73
SIGNAL3
  Top 0.305: IC3.7 IC3.6 IC3.5 IC3.4 IC3.3 30.8,25.37 | 30.8,25.37 IC3.2 31.43,23.81 35.24,23.81 35.24,25.08 42.86,25.08 43.18,24.77 43.18,21.59 43.81,20.95 IC5.3 | R26.2 30.8,25.37
SWITCH
  Top 0.457: IC2.6 49.84,48.64 C10.2
  pour Top (isolate 0.305, no thermals): 49.85,48.9 49.85,46.99 49.53,46.67 49.53,42.23 47.62,42.23 47.62,47.62 48.9,48.9
VIN
  Top 0.61: D1.A 44.98,73.44 44.45,73.98 35.88,73.98 35.24,73.34 CON1.5

### Text on the board
tPlace: A | B | C | EN | 24V | GND | NPN | PNP | NPN | PNP | NPN | PNP | ~ | ~ | soldernerd.com | Universal Interface | ABC | 111 | 110 | 101 | 100 | 011 | 010 | 001 | 000 | ON | OFF | INV | INV | INV | PNP | NPN | ~ | PP | PD | Relay | Outputs | Rev A / 2019 | ON | COM | OFF | GND | OC | 24V | 5V
bPlace: Rev A - 2019 | soldernerd.com | Lukas Fässler | Universal Interface